# Altium schematic sheet Mounting_Holes.SchDoc
size A4
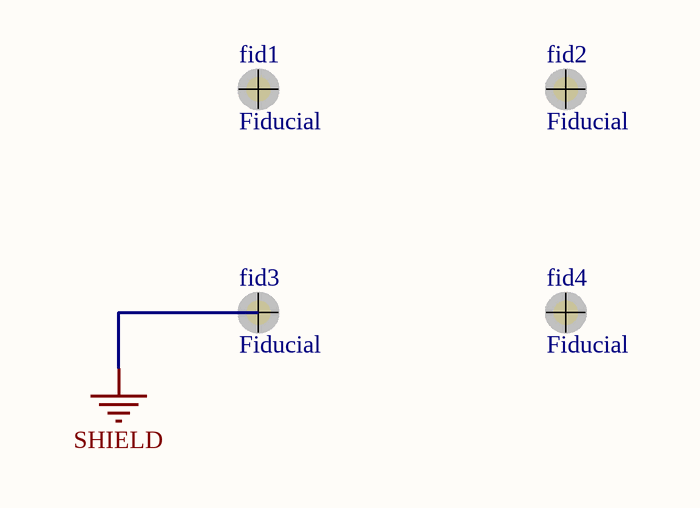
[diagram p0: Mounting_Holes.SchDoc]

## Parts
fid1  Fiducial  [MountingHole_PCB]
fid2  Fiducial  [MountingHole_PCB]
fid3  Fiducial  [MountingHole_PCB]
fid4  Fiducial  [MountingHole_PCB]

## Library data of the parts
fid1-fid4 = Mounting_Holes: Part Number: Mounting_Holes